# Altium schematic sheet SCH_06_Input.SchDoc
size A4; DrawnBy: Phung Nhat Minh; SheetNumber: 6; SheetTotal: 7; SPICEModelCacheHRPQVLRP: <root> / <DocumentId>HRPQVLRP</DocumentId> / </root>
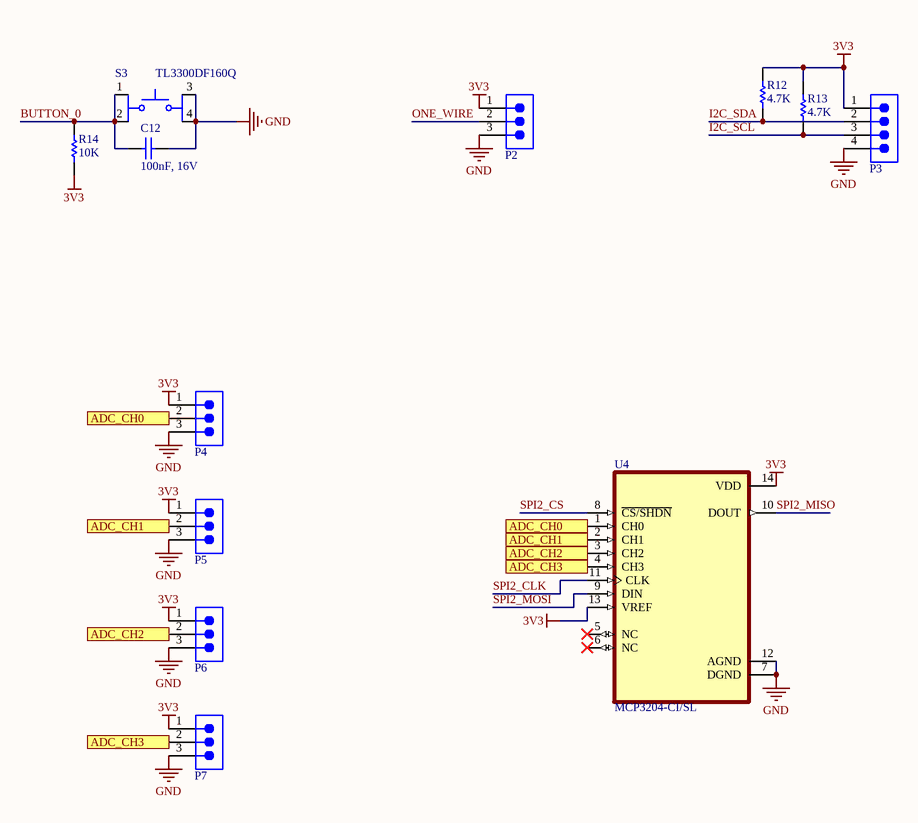
[diagram p0: SCH_06_Input.SchDoc]

## Parts
C12  100nF, 16V  [WCAP-CSGP_0603_H=0.8mm_Reflow]
P2  691312510003  [691312510003]  (value not drawn)
P3  691312510004  [691312510004]  (value not drawn)
P4  691312510003  [691312510003]  (value not drawn)
P5  691312510003  [691312510003]  (value not drawn)
P6  691312510003  [691312510003]  (value not drawn)
P7  691312510003  [691312510003]  (value not drawn)
R12  value 4.7K  [RES-SM-0603]  (hidden comment: RESISTOR SMD)
R13  value 4.7K  [RES-SM-0603]  (hidden comment: RESISTOR SMD)
R14  value 10K  [RES-SM-0603]  (hidden comment: RESISTOR SMD)
S3  TL3300DF160Q  [SW_TL3300DF160Q]
U4  MCP3204-CI/SL  [SOIC127P600X175-14N]

## Ports
ADC_CH0 (in, see SCH_06_Input[1C]), ADC_CH0 (out, see SCH_06_Input[2C]), ADC_CH1 (in, see SCH_06_Input[1C]), ADC_CH1 (out, see SCH_06_Input[2C]), ADC_CH2 (in, see SCH_06_Input[1C]), ADC_CH2 (out, see SCH_06_Input[2C]), ADC_CH3 (in, see SCH_06_Input[1D]), ADC_CH3 (out, see SCH_06_Input[2C])

## Nets
3V3: P2.1 P3.1 P4.1 P5.1 P6.1 P7.1 R12.2 R13.2 R14.2 U4.13(VREF) U4.14(VDD)
GND: C12.1 P2.3 P3.4 P4.3 P5.3 P6.3 P7.3 S3.3 S3.4 U4.7(DGND) U4.12(AGND)
ADC_CH0: P4.2 U4.1(CH0) ; port ADC_CH0
ADC_CH1: P5.2 U4.2(CH1) ; port ADC_CH1
ADC_CH2: P6.2 U4.3(CH2) ; port ADC_CH2
ADC_CH3: P7.2 U4.4(CH3) ; port ADC_CH3
BUTTON_0: C12.2 R14.1 S3.1 S3.2
I2C_SCL: P3.3 R13.1
I2C_SDA: P3.2 R12.1
ONE_WIRE: P2.2
SPI2_CLK: U4.11(CLK)
SPI2_CS: U4.8(~{CS/SHDN})
SPI2_MISO: U4.10(DOUT)
SPI2_MOSI: U4.9(DIN)

Not connected (* = marked no-connect by the designer): U4 5(NC)* 6(NC)*

## Notes on the sheet
- Title
- Size
- Date:
- A4
- Number
- Revision
- Time:
- Drawn By:
- Checked By:

## Library data of the parts
C12 = 885012206046: WCAP-CSGP Multilayer Ceramic Chip Capacitor, General Purpose, size 0603, X7R, 100nF, 16V; Manufacturer: Wurth Elektronik; Rated Voltage: 16VDC; Isolation Resistance: >=5GOhm; Capacitance Tolerance: +/-10%; Technical Reference: X7R0603104K016DFCT10000; ComponentLink1Description: Manufacturer; ComponentLink1URL: http://www.we-online.de; ComponentLink2Description: Datasheet; ComponentLink2URL: https://www.we-online.com/catalog/datasheet/885012206046.pdf; Operating Temperature: -55 to +125degC; Packaging: Tape and Reel; Manufacturer Part Number: 885012206046; Published Date: May 2020; Ceramic Type: X7R; Dissipation Factor: =<3.5%; Height: 0.8mm; Mounting Technology: SMT; Size: 0603; Capacitance: 100nF
P2 P4-P7 = 691312510003: WR-TBL Series 312 Open Horizontal PCB Header, THT, pitch 5.08mm, 3p; Manufacturer: Wurth Elektronik; Modularity: No; Rated Current: 20A; Working Voltage: 300V; ComponentLink1Description: Website Link; ComponentLink1URL: https://www.we-online.com/redexpert/article/691312510003?ad; ComponentLink2Description: Datasheet Link; ComponentLink2URL: https://www.we-online.com/redexpert/spec/691312510003?ad; Manufacturer Part Number: 691312510003; Category: Terminal Blocks; Match Code: WR-TBL; Mount: Through Hole; Operating Temperature Max: 105°C; Operating Temperature Min: -40°C; Packaging: Box; Application: Pluggable; Number of Pins: 3; Number of Rows: 1; Orientation: Horizontal; Pitch: 5.08mm
P3 = 691312510004: WR-TBL Series 312 Open Horizontal PCB Header, THT, pitch 5.08mm, 4p; Manufacturer: Wurth Elektronik; Modularity: No; Rated Current: 20A; Working Voltage: 300V; ComponentLink1Description: Website Link; ComponentLink1URL: https://www.we-online.com/redexpert/article/691312510004?ad; ComponentLink2Description: Datasheet Link; ComponentLink2URL: https://www.we-online.com/redexpert/spec/691312510004?ad; Manufacturer Part Number: 691312510004; Category: Terminal Blocks; Match Code: WR-TBL; Mount: Through Hole; Operating Temperature Max: 105°C; Operating Temperature Min: -40°C; Packaging: Box; Application: Pluggable; Number of Pins: 4; Number of Rows: 1; Orientation: Horizontal; Pitch: 5.08mm
R12-R14 = RESISTOR SMD: Resistor
U4 = MCP3204-CI/SL: 12 Bit Analog to Digital Converter 2, 4 Input 1 SAR 14-SOIC; MF: Microchip; Check_prices: https://www.snapeda.com/parts/MCP3204-CI/SL/Microchip/view-part/?ref=eda; Value: *; Availability: In Stock; MP: MCP3204-CI/SL; Price: None; Package: SOIC-14 Microchip; SnapEDA_Link: https://www.snapeda.com/parts/MCP3204-CI/SL/Microchip/view-part/?ref=snap; Purchase-URL: https://pricing.snapeda.com/search/part/MCP3204-CI/SL/?ref=eda
S3 = TL3300DF160Q: Price: None; MP: TL3300DF160Q; Availability: Unavailable; Package: None; Value: *